# Altium schematic sheet loom-top.SchDoc
size 297 x 209 mm
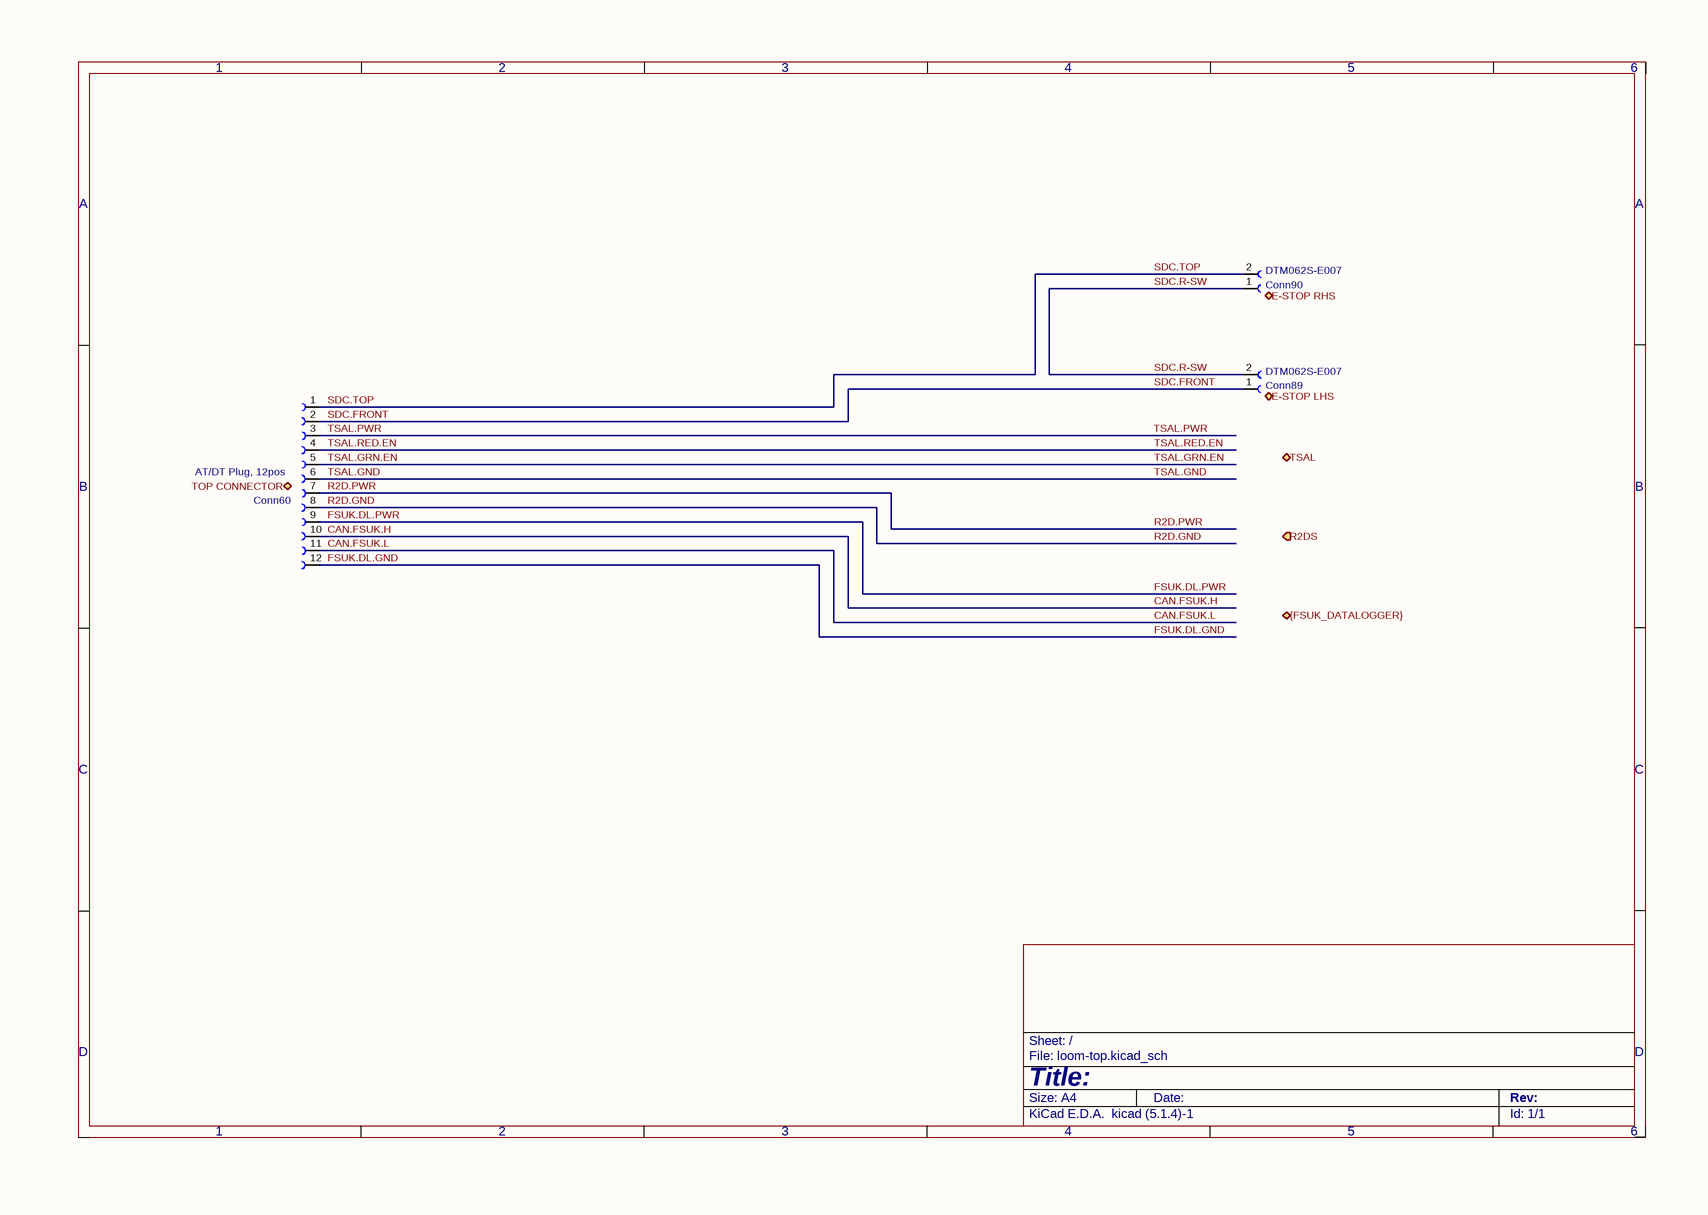
[diagram p0: loom-top.SchDoc]

## Parts
Conn60  P/N: AT/DT Plug, 12pos  (hidden comment: Deutsch_DTM_12S_Pin)
Conn89  P/N: DTM062S-E007  (hidden comment: Deutsch_DTM_2S_Pin)
Conn90  P/N: DTM062S-E007  (hidden comment: Deutsch_DTM_2S_Pin)

## Ports
E-STOP LHS (bidir), E-STOP RHS (bidir), R2DS (in), TOP CONNECTOR (bidir), TSAL (bidir), {FSUK_DATALOGGER} (bidir)

## Nets
CAN.FSUK.H: Conn60.10
CAN.FSUK.L: Conn60.11
FSUK.DL.GND: Conn60.12
FSUK.DL.PWR: Conn60.9
R2D.GND: Conn60.8
R2D.PWR: Conn60.7
SDC.FRONT: Conn60.2 Conn89.1
SDC.R-SW: Conn89.2 Conn90.1
SDC.TOP: Conn60.1 Conn90.2
TSAL.GND: Conn60.6
TSAL.GRN.EN: Conn60.5
TSAL.PWR: Conn60.3
TSAL.RED.EN: Conn60.4

## Notes on the sheet
- 1
- 2
- 3
- 4
- 5
- 6
- A
- B
- C
- D
- Title:
- File: loom-top.kicad_sch
- Sheet: /
- KiCad E.D.A.  kicad (5.1.4)-1
- Size: A4
- Date:
- Rev:
- Id: 1/1

## Library data of the parts
Conn60 = Deutsch_DTM_12S_Pin: Value: Deutsch_DTM_12S_Pin
Conn89 Conn90 = Deutsch_DTM_2S_Pin: Value: Deutsch_DTM_2S_Pin